# Altium schematic sheet GDO.SchDoc
size A; Author: LWR; DrawnBy: LWR; Engineer: LWR; SheetNumber: 1; SheetTotal: 1
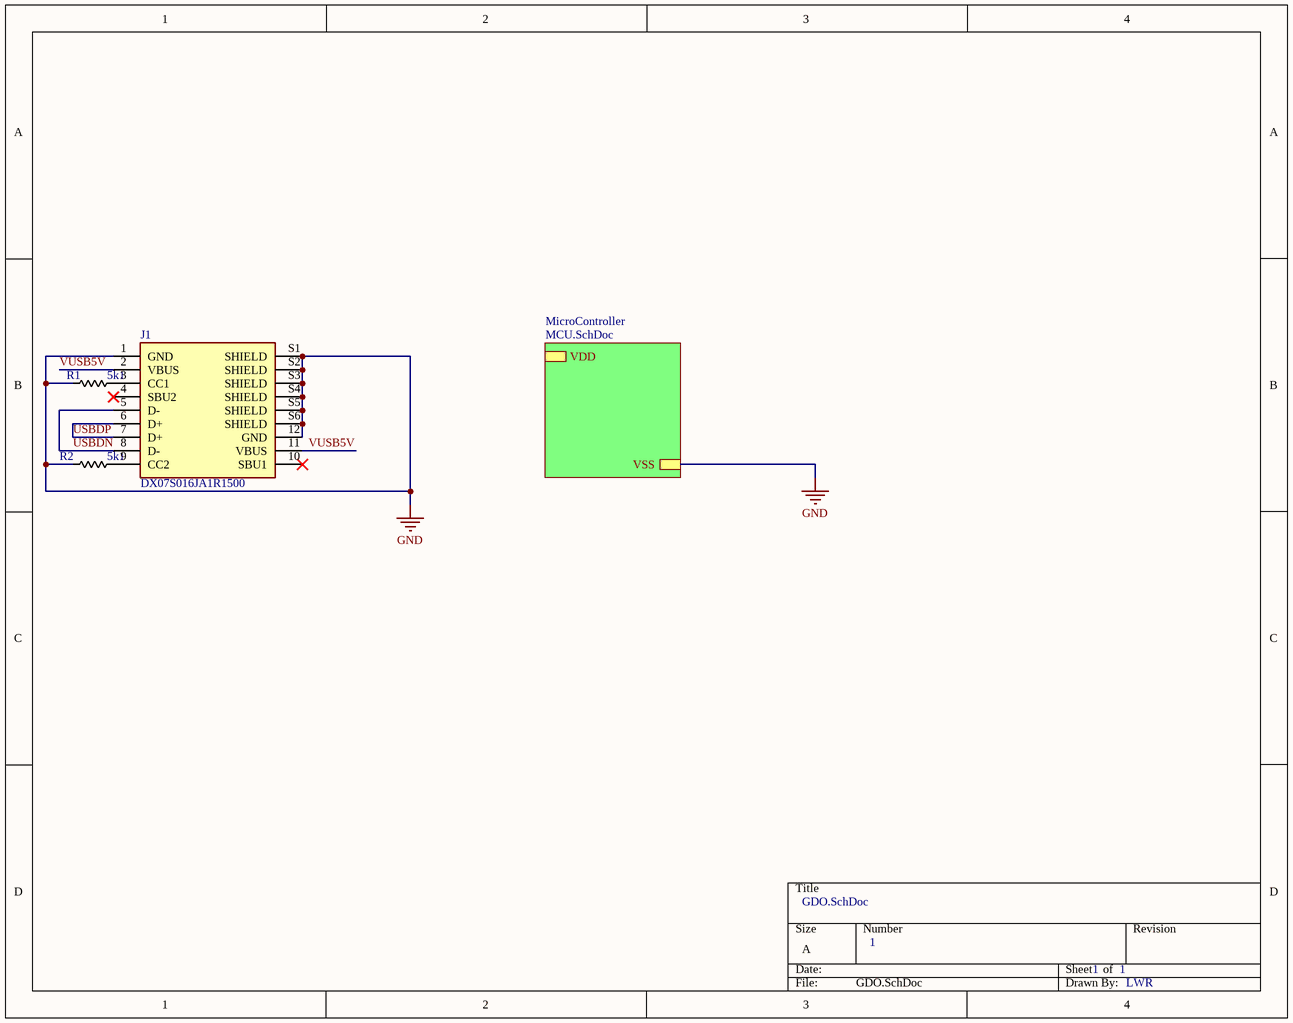
[diagram p0: GDO.SchDoc]

## Parts
J1  DX07S016JA1R1500  [DX07S016JA1R1500]
R1  5k1  [R0603]
R2  5k1  [R0603]

## Sub-sheets
MicroController = MCU.SchDoc: VDD, VSS

## Nets
GND: J1.1(GND) J1.12(GND) J1.S1(SHIELD) J1.S2(SHIELD) J1.S3(SHIELD) J1.S4(SHIELD) J1.S5(SHIELD) J1.S6(SHIELD) R1.1 R2.1 ; sheet MicroController/VSS
USBDN: J1.5(D-) J1.8(D-)
USBDP: J1.6(D+) J1.7(D+)
VUSB5V: J1.2(VBUS) J1.11(VBUS)
NetJ1_3: J1.3(CC1) R1.2
NetJ1_9: J1.9(CC2) R2.2

Not connected (* = marked no-connect by the designer): J1 4(SBU2)* 10(SBU1)*

## Library data of the parts
J1 = DX07S016JA1R1500: USB-C USB 2.0 Receptacle Connector, Right Angle; Populate: P; Value: DX07S016JA1R1500; ComponentLink1Description: PartLink; ComponentLink1URL: https://www.mouser.com/ProductDetail/JAE-Electronics/DX07S016JA1R1500?qs=GBLSl2Akirucb2YMMGCxCQ%3D%3D
R1 R2 = R0603: Tolerance: <=10%; Power: >=1/10W; Value: 5k1; ComponentLink1Description: PartLink